# EAGLE design SimpleCharger-LiIon-OpampBased-LM358 (EAGLE 7.6.0)
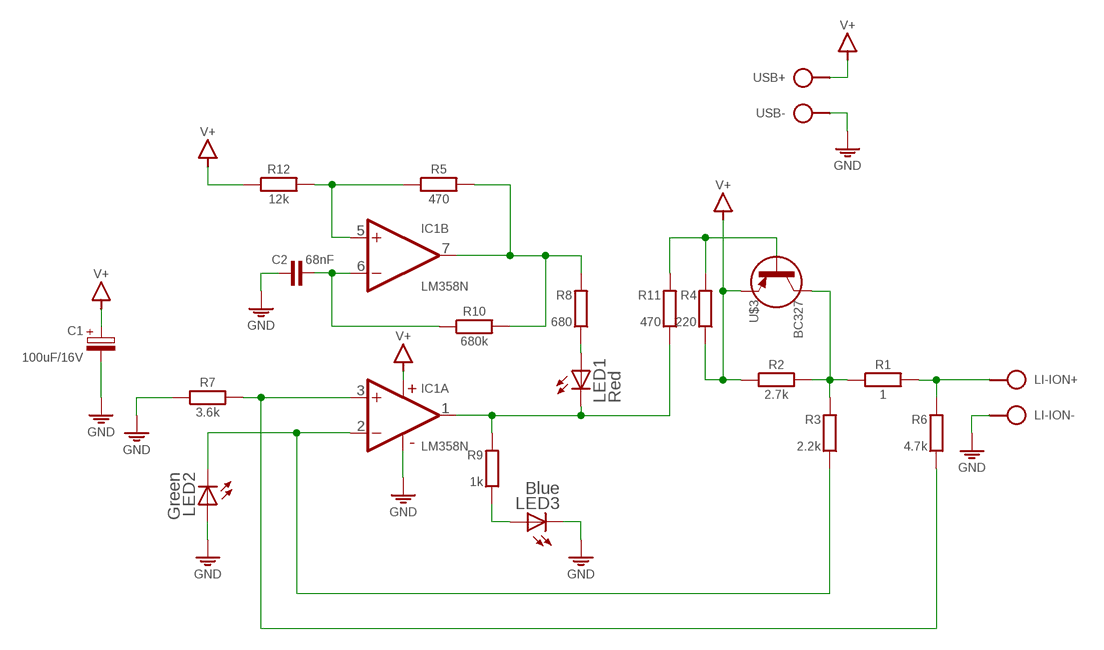
[diagram p0: schematic, sheet 1]

## Parts
C1  100uF/16V  CPOLE2.5-5  [E2,5-5]
C2  68nF  C-H075-020X044/V  [C075-020X044/V]
IC1  LM358N  [DIL08]
LED1  Red  LED3MM  [LED3MM]
LED2  Green  LED3MM  [LED3MM]
LED3  Blue  LED3MM  [LED3MM]
LI-ION  SPAD+-+-  [SPAD+-]
R1  1  R-H0204/10  [0204/10]
R2  2.7k  R-H0204/10-V  [0204/10-V]
R3  2.2k  R0204/10-V  [0204/10-V]
R4  220  R0204/10-V  [0204/10-V]
R5  470  R-H0204/7-V  [0204/7-V]
R6  4.7k  R0204/10-V  [0204/10-V]
R7  3.6k  R-H0204/10  [0204/10]
R8  680  R0204/10-V  [0204/10-V]
R9  1k  R0204/10  [0204/10]
R10  680k  R-H0204/10-V  [0204/10-V]
R11  470  R0204/10-V  [0204/10-V]
R12  12k  R-H0204/10-V  [0204/10-V]
U$3  BC327  [TO92]
USB  SPAD+--+  [SPAD-+]

## Nets
GND: C1.- C2.1 IC1.4(P:V-) LED2.A LED3.K(C) LI-ION.1 R7.1 USB.1
N$1: IC1.5(B:+IN) R5.1 R12.2
N$2: IC1.7(B:OUT) R5.2 R8.1 R10.2
N$3: C2.2 IC1.6(B:-IN) R10.1
N$5: IC1.2(A:-IN) LED2.K(C) R3.2
N$6: LED3.A R9.1
N$7: IC1.1(A:OUT) LED1.K(C) R9.2 R11.2
N$8: LED1.A R8.2
N$9: R4.1 R11.1 U$3.2(B)
N$11: R1.1 R2.2 R3.1 U$3.1(C)
N$12: LI-ION.2 R1.2 R6.1
N$13: IC1.3(A:+IN) R6.2 R7.2
V+: C1.+ IC1.8(P:V+) R2.1 R4.2 R12.1 U$3.3(E) USB.2

## Library data of the parts
C1 = c:CPOL: POLARIZED CAPACITOR, European symbol
C2 = c:C-H
IC1 = ic:LM358: OP AMP also LM158; LM258; LM2904 Source: http://cache.national.com/ds/LM/LM158.pdf
LED1-LED3 = led:LED: LED OSRAM: - CHIPLED LG R971, LG N971, LY N971, LG Q971, LY Q971, LO R971, LY R971 LH N974, LH R974 LS Q976, LO Q976, LY Q976 LO Q996 - Hyper CHIPLED LW Q18S LB Q993, LB Q99A, LB R99A - SideLED LS A670, LO A670, LY A670, LG A670, LP A670 LB A673, LV A673, LT A673, LW A673 LH A674 LY A675 LS A676, LA A676, LO A676, LY A676, LW A676 LS A679, LY A679, LG A679 - Hyper Micro SIDELED® LS Y876, LA Y876, LO Y876, LY Y876 LT Y87S - SmartLED LW L88C, LW L88S LB L89C, LB L89S, LG L890 LS L89K, LO L89K, LY L89K LS L896, LA L896, LO L896, LY L896 - TOPLED LS T670, LO T670, LY T670, LG T670, LP T670 LSG T670, LSP T670, LSY T670, LOP T670, LYG T670 LG T671, LOG T671, LSG T671 LB T673, LV T673, LT T673, LW T673 LH T674 LS T676, LA T676, LO T676, LY T676, LB T676, LH T676, LSB T676, LW T676 LB T67C, LV T67C, LT T67C, LS T67K, LO T67K, LY T67K, LW E67C LS E67B, LA E67B, LO E67B, LY E67B, LB E67C, LV E67C, LT E67C LW T67C LS T679, LY T679, LG T679 LS T770, LO T770, LY T770, LG T770, LP T770 LB T773, LV T773, LT T773, LW T773 LH T774 LS E675, LA E675, LY E675, LS T675 LS T776, LA T776, LO T776, LY T776, LB T776 LHGB T686 LT T68C, LB T68C - Hyper Mini TOPLED® LB M676 - Mini TOPLED Santana® LG M470 LS M47K, LO M47K, LY M47K Source: http://www.osram.convergy.de LUXEON: - LUMILED® LXK2-PW12-R00, LXK2-PW12-S00, LXK2-PW14-U00, LXK2-PW14-V00 LXK2-PM12-R00, LXK2-PM12-S00, LXK2-PM14-U00 LXK2-PE12-Q00, LXK2-PE12-R00, LXK2-PE12-S00, LXK2-PE14-T00, LXK2-PE14-U00 LXK2-PB12-K00, LXK2-PB12-L00, LXK2-PB12-M00, LXK2-PB14-N00, LXK2-PB14-P00, LXK2-PB14-Q00 LXK2-PR12-L00, LXK2-PR12-M00, LXK2-PR14-Q00, LXK2-PR14-R00 LXK2-PD12-Q00, LXK2-PD12-R00, LXK2-PD12-S00 LXK2-PH12-R00, LXK2-PH12-S00 LXK2-PL12-P00, LXK2-PL12-Q00, LXK2-PL12-R00 Source: www.luxeon.com KINGBRIGHT: KA-3528ASYC Source: www.kingbright.com
LI-ION USB = pad:SPAD+-
R1 R2 R5 R7 R10 R12 = r:R-H
R3 R4 R6 R8 R9 R11 = r:R: RESISTOR, European symbol
U$3 = t:BC327

## Board
Simple LM358 OP-AMP based USB Li-ion charger https://www.circuitsdiy.com/simple-lm358-op-amp-based-usb-li-ion-charger/ https://www.circuitsdiy.com/usb-li-ion-charger-revision/
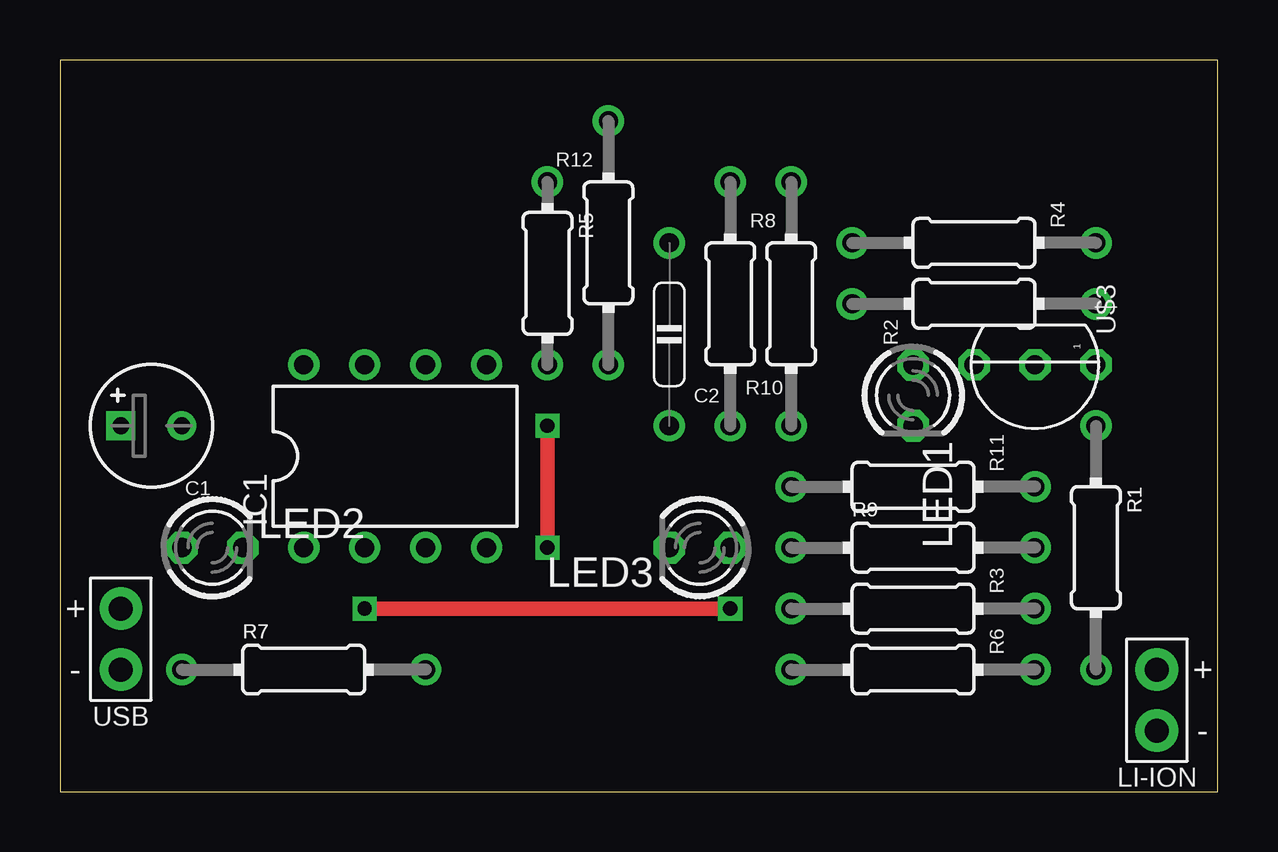
[diagram p1: board, top side]
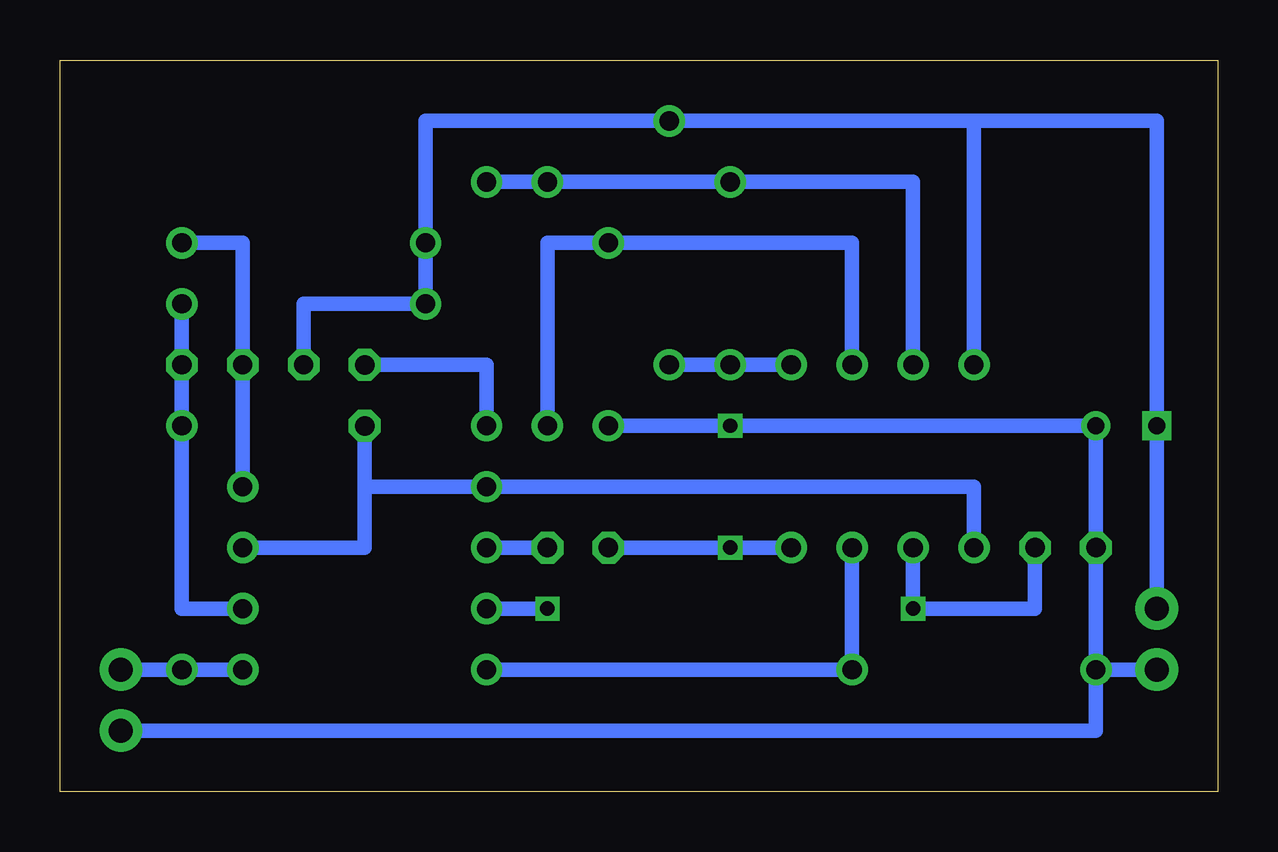
[diagram p2: board, bottom side, seen from below]

Size 48.26 x 30.48 mm. Coordinates in mm from the lower left corner, seen from the top.
Outline: 0,0 48.26,0 48.26,30.48 0,30.48 0,0
Copper layers (1*16): Top 0.035mm / dielectric 1.5mm / Bottom 0.035mm
Design rules "default": minimum track width 10mil, minimum drill 24mil, track to track 8mil, track to pad 8mil, pad to pad 8mil, via to via 8mil, smd to smd 8mil, copper to edge 40mil, drill to drill 8mil, minimum pad ring 10mil, minimum via ring 8mil, stop-mask expansion 4mil, vias tented up to drill 0mil, thermal gap 10mil

### Footprints (pad centres in the part's own frame; a part is rotated, then mirrored left to right if it is on the bottom)
E2,5-5 = drill 0.7 square: + 1.27,0 | drill 0.7: - -1.27,0
C075-020X044/V = drill 0.8: 1 0,3.81; 2 0,-3.81
DIL08 = drill 0.8 pad 1.27: 1 -3.81,-3.81; 2 -1.27,-3.81; 3 1.27,-3.81; 4 3.81,-3.81; 5 3.81,3.81; 6 1.27,3.81; 7 -1.27,3.81; 8 -3.81,3.81
LED3MM = drill 0.813 octagon: A -1.27,0; K 1.27,0
SPAD+- = drill 1 pad 1.778: 1 0,-1.27; 2 0,1.27
0204/10 = drill 0.8: 1 -5.08,0; 2 5.08,0
0204/10-V = drill 0.8: 1 0,5.08; 2 0,-5.08
0204/7-V = drill 0.8: 1 0,3.81; 2 0,-3.81
TO92 = drill 0.8 octagon: 1 0,2.54; 2 0,0; 3 0,-2.54
SPAD-+ = drill 1 pad 1.778: 1 0,-1.27; 2 0,1.27

### Placement (x,y rotation side)
C1  3.81,15.24 180 top
C2  25.4,19.05 180 top
IC1  13.97,13.97 0 top
LED1  35.56,16.51 270 top
LED2  6.35,10.16 0 top
LED3  26.67,10.16 180 top
LI-ION  45.72,3.81 0 top
R1  43.18,10.16 270 top
R2  38.1,20.32 90 top
R3  35.56,7.62 270 top
R4  38.1,22.86 270 top
R5  20.32,21.59 180 top
R6  35.56,5.08 270 top
R7  10.16,5.08 0 top
R8  30.48,20.32 0 top
R9  35.56,10.16 0 top
R10  27.94,20.32 180 top
R11  35.56,12.7 270 top
R12  22.86,22.86 0 top
U$3  40.64,17.78 270 top
USB  2.54,6.35 0 top

### Tracks (layer width: path | path; a pad name or v marks a point on that pad's centre or on a via)
GND  (via drill 0.6)
  Top 0.61: v20.32,10.16 v20.32,15.24
  Bottom 0.61: R7.1 5.08,2.54 LI-ION.1 | R7.1 LED2.A C1.- v20.32,15.24 C2.1 | R7.1 USB.1 | IC1.4 v20.32,10.16 LED3.K
N$1
  Bottom 0.61: IC1.5 R5.1 R12.2
N$2
  Bottom 0.61: IC1.7 12.7,25.4 R5.2 R10.2 R8.1
N$3
  Bottom 0.61: IC1.6 15.24,22.86 C2.2 27.94,22.86 R10.1
N$5  (via drill 0.6)
  Top 0.61: v27.94,7.62 v12.7,7.62
  Bottom 0.61: R3.2 v27.94,7.62 | IC1.2 v12.7,7.62 7.62,7.62 LED2.K
N$6
  Bottom 0.61: LED3.A R9.1
N$7
  Bottom 0.61: IC1.1 10.16,12.7 R11.2 35.56,12.7 | 35.56,12.7 35.56,10.16 R9.2 | LED1.K 35.56,12.7
N$8
  Bottom 0.61: R8.2 30.48,17.78 LED1.A
N$9
  Bottom 0.61: R11.1 U$3.2 40.64,22.86 R4.1
N$11
  Bottom 0.61: R2.2 U$3.1 R1.1 43.18,7.62 R3.1
N$12
  Bottom 0.61: R6.1 R1.2 LI-ION.2
N$13
  Bottom 0.61: IC1.3 R7.2 R6.2
V+
  Bottom 0.61: U$3.3 38.1,20.32 R2.1 R4.2 33.02,27.94 R12.1 10.16,27.94 | USB.2 C1.+ 2.54,27.94 10.16,27.94 | 10.16,27.94 IC1.8